# EasyEDA schematic 8bit.json

## Sheets
1 PC
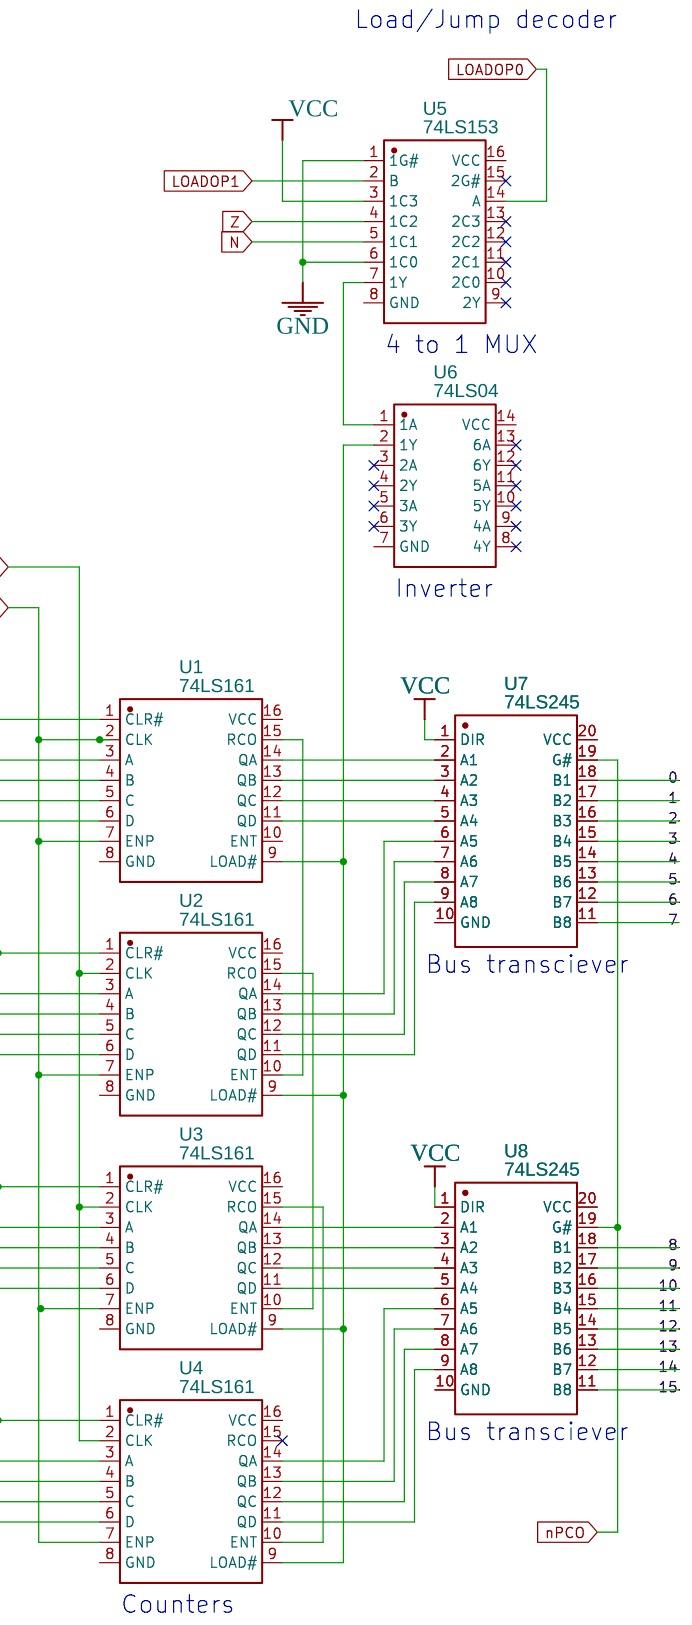
[diagram p0: PC]
2 ALU
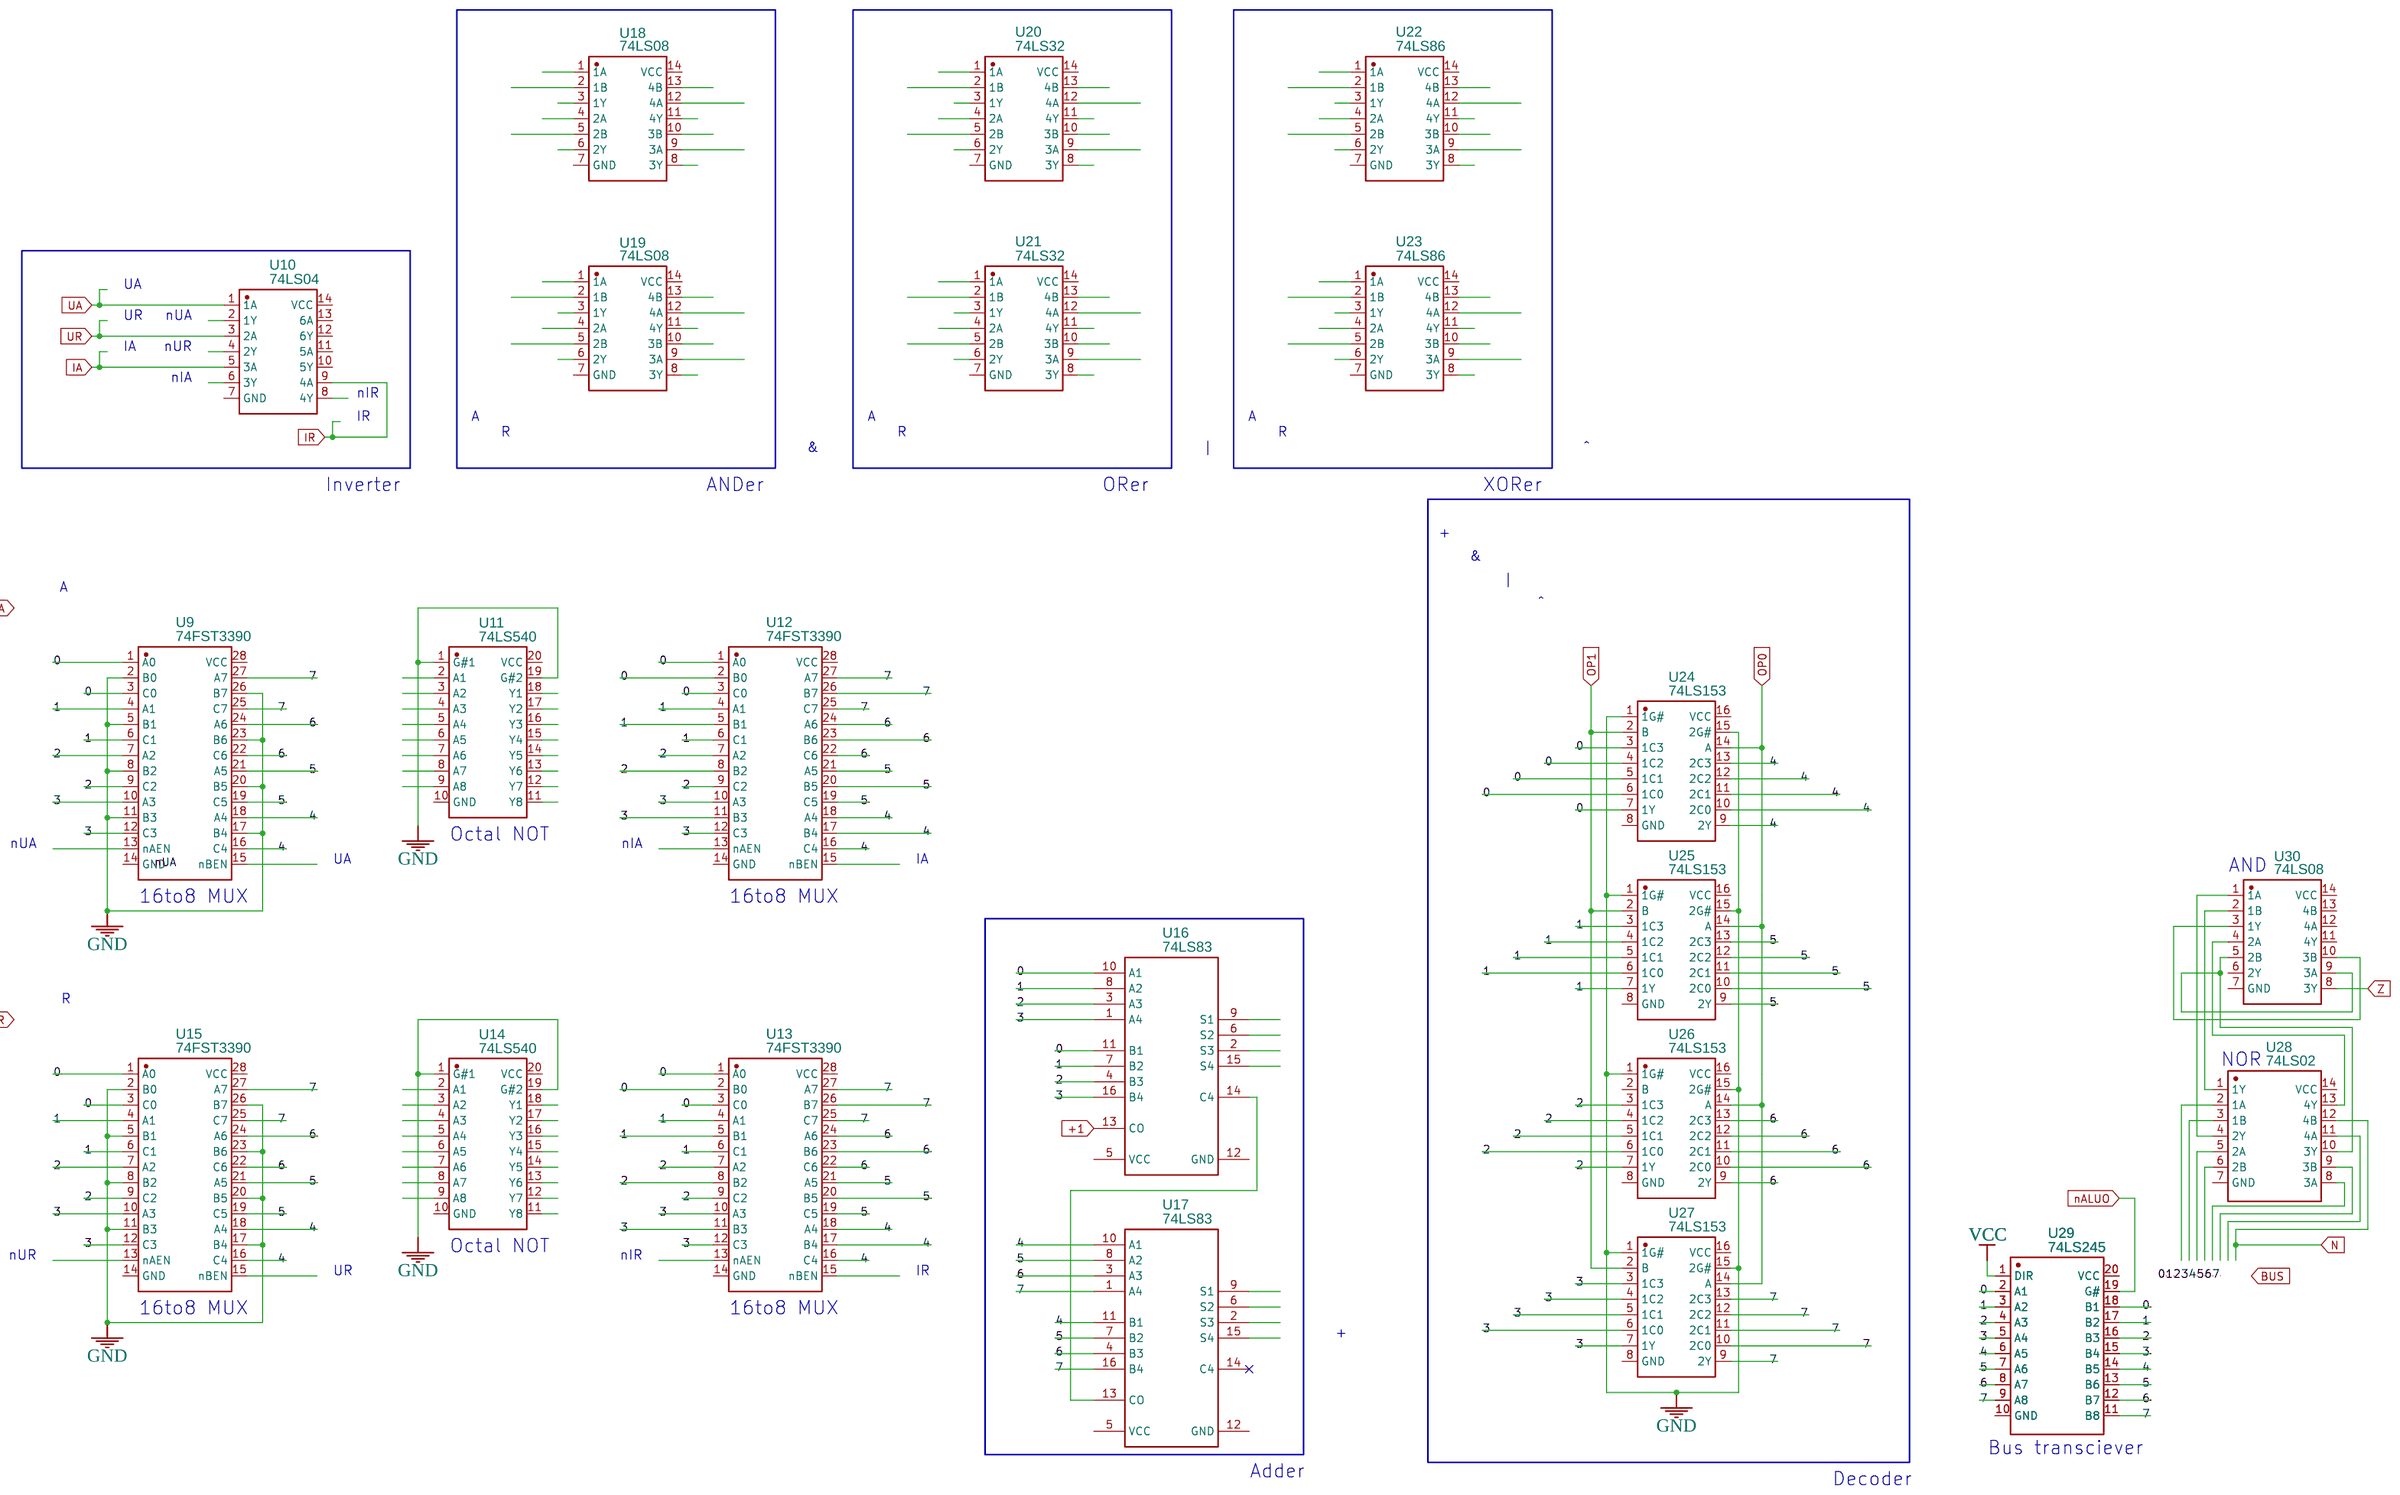
[diagram p1: ALU]

## Parts
sheet ALU
U9  74FST3390
U10  74LS04  [SOP-14_L8.6-W3.9-P1.27-LS6.0-BL]
U11  74LS540  [SOIC-20_L12.8-W7.5-P1.27-LS10.3-BL]
U12  74FST3390
U13  74FST3390
U14  74LS540  [SOIC-20_L12.8-W7.5-P1.27-LS10.3-BL]
U15  74FST3390
U16  74LS83  [DIP16]
U17  74LS83  [DIP16]
U18  74LS08  [SOP-14_L8.6-W3.9-P1.27-LS6.0-BL]
U19  74LS08  [SOP-14_L8.6-W3.9-P1.27-LS6.0-BL]
U20  74LS32  [SOIC-14_L8.7-W3.9-P1.27-LS6.0-BL]
U21  74LS32  [SOIC-14_L8.7-W3.9-P1.27-LS6.0-BL]
U22  74LS86  [DIP-14_L20.0-W7.6-P2.54-LS7.6-BL]
U23  74LS86  [DIP-14_L20.0-W7.6-P2.54-LS7.6-BL]
U24  74LS153  [SOIC-16_L9.9-W3.9-P1.27-LS6.0-BL]
U25  74LS153  [SOIC-16_L9.9-W3.9-P1.27-LS6.0-BL]
U26  74LS153  [SOIC-16_L9.9-W3.9-P1.27-LS6.0-BL]
U27  74LS153  [SOIC-16_L9.9-W3.9-P1.27-LS6.0-BL]
U28  74LS02  [SOIC-14_L8.7-W3.9-P1.27-LS6.0-BL]
U29  74LS245  [SOIC-20_L13.0-W7.6-P1.27-LS10.3-BL]
U30  74LS08  [SOP-14_L8.6-W3.9-P1.27-LS6.0-BL]
sheet PC
U1  74LS161  [PDIP-16_L19.3-W6.4-P2.54-LS7.9-BL]
U2  74LS161  [PDIP-16_L19.3-W6.4-P2.54-LS7.9-BL]
U3  74LS161  [PDIP-16_L19.3-W6.4-P2.54-LS7.9-BL]
U4  74LS161  [PDIP-16_L19.3-W6.4-P2.54-LS7.9-BL]
U5  74LS153  [PDIP-16_L19.3-W6.4-P2.54-LS7.9-BL]
U6  74LS04  [SOP-14_L8.6-W3.9-P1.27-LS6.0-BL]
U7  74LS245  [SOIC-20_L13.0-W7.6-P1.27-LS10.3-BL]
U8  74LS245  [SOIC-20_L13.0-W7.6-P1.27-LS10.3-BL]

## Library data of the parts
U9 U12 U13 U15 = 74FST3390: Contributor: Guest
U6 U10 = XL74LS04: Supplier: LCSC; Supplier Part: C513511; Manufacturer: XINLUDA(信路达); Contributor: LCSC; JLCPCB Part Class: Extended Part
U11 U14 = SN74LS540DW: Supplier: LCSC; Supplier Part: C1548464; Manufacturer: TI(德州仪器); JLCPCB Part Class: Extended Part; Contributor: LCSC
U16 U17 = HD74LS83AP: 4-bit Binary Full Adder with Fast Carry
U18 U19 U30 = XL74LS08: Supplier: LCSC; Supplier Part: C521140; Manufacturer: XINLUDA(信路达); Contributor: LCSC; JLCPCB Part Class: Extended Part
U20 U21 = SN74LS32D: Supplier: LCSC; Supplier Part: C2869302; Manufacturer: TI(德州仪器); link: https://atta.szlcsc.comnull; Contributor: LCSC
U22 U23 = XD74LS86: Supplier: LCSC; Supplier Part: C556290; Manufacturer: XINLUDA(信路达); Contributor: LCSC; JLCPCB Part Class: Extended Part
U24-U27 = SN74LS153D: Supplier: LCSC; Supplier Part: C1547147; Manufacturer: TI(德州仪器); Contributor: LCSC; JLCPCB Part Class: Extended Part
U28 = SN74LS02D: Supplier: LCSC; Supplier Part: C2878666; Manufacturer: TI(德州仪器); link: https://atta.szlcsc.comnull; Contributor: LCSC
U7 U8 U29 = 74LS245WMX: Supplier: LCSC; Manufacturer: TI; Supplier Part: C6034
U1-U4 = SN74LS161AN: Supplier: LCSC; Supplier Part: C1547960; Manufacturer: TI(德州仪器); Contributor: LCSC; JLCPCB Part Class: Extended Part
U5 = SN74LS153N: Supplier: LCSC; Supplier Part: C1547278; Manufacturer: TI(德州仪器); Contributor: LCSC; JLCPCB Part Class: Extended Part

## Nets
GND: U5.1(1G#) U5.6(1C0) U9.2(B0) U9.5(B1) U9.8(B2) U9.11(B3) U9.17(B4) U9.20(B5) U9.23(B6) U9.26(B7) U11.1(G#1) U11.19(G#2) U14.1(G#1) U14.19(G#2) U15.2(B0) U15.5(B1) U15.8(B2) U15.11(B3) U15.17(B4) U15.20(B5) U15.23(B6) U15.26(B7) U24.1(1G#) U24.15(2G#) U25.1(1G#) U25.15(2G#) U26.1(1G#) U26.15(2G#) U27.1(1G#) U27.15(2G#)
VCC: U5.3(1C3) U7.1(DIR) U8.1(DIR) U29.1(DIR)
0: U1.3(A) U7.18(B1) U9.1(A0) U9.3(C0) U12.1(A0) U12.2(B0) U12.3(C0) U13.1(A0) U13.2(B0) U13.3(C0) U15.1(A0) U15.3(C0) U16.10(A1) U16.11(B1) U24.3(1C3) U24.4(1C2) U24.5(1C1) U24.6(1C0) U24.7(1Y) U29.2(A1) U29.18(B1)
1: U1.4(B) U7.17(B2) U9.4(A1) U9.6(C1) U12.4(A1) U12.5(B1) U12.6(C1) U13.4(A1) U13.5(B1) U13.6(C1) U15.4(A1) U15.6(C1) U16.7(B2) U16.8(A2) U25.3(1C3) U25.4(1C2) U25.5(1C1) U25.6(1C0) U25.7(1Y) U29.3(A2) U29.17(B2)
2: U1.5(C) U7.16(B3) U9.7(A2) U9.9(C2) U12.7(A2) U12.8(B2) U12.9(C2) U13.7(A2) U13.8(B2) U13.9(C2) U15.7(A2) U15.9(C2) U16.3(A3) U16.4(B3) U26.3(1C3) U26.4(1C2) U26.5(1C1) U26.6(1C0) U26.7(1Y) U29.4(A3) U29.16(B3)
3: U1.6(D) U7.15(B4) U9.10(A3) U9.12(C3) U12.10(A3) U12.11(B3) U12.12(C3) U13.10(A3) U13.11(B3) U13.12(C3) U15.10(A3) U15.12(C3) U16.1(A4) U16.16(B4) U27.3(1C3) U27.4(1C2) U27.5(1C1) U27.6(1C0) U27.7(1Y) U29.5(A4) U29.15(B4)
4: U2.3(A) U7.14(B5) U9.16(C4) U9.18(A4) U12.16(C4) U12.17(B4) U12.18(A4) U13.16(C4) U13.17(B4) U13.18(A4) U15.16(C4) U15.18(A4) U17.10(A1) U17.11(B1) U24.9(2Y) U24.10(2C0) U24.11(2C1) U24.12(2C2) U24.13(2C3) U29.6(A5) U29.14(B5)
5: U2.4(B) U7.13(B6) U9.19(C5) U9.21(A5) U12.19(C5) U12.20(B5) U12.21(A5) U13.19(C5) U13.20(B5) U13.21(A5) U15.19(C5) U15.21(A5) U17.7(B2) U17.8(A2) U25.9(2Y) U25.10(2C0) U25.11(2C1) U25.12(2C2) U25.13(2C3) U29.7(A6) U29.13(B6)
6: U2.5(C) U7.12(B7) U9.22(C6) U9.24(A6) U12.22(C6) U12.23(B6) U12.24(A6) U13.22(C6) U13.23(B6) U13.24(A6) U15.22(C6) U15.24(A6) U17.3(A3) U17.4(B3) U26.9(2Y) U26.10(2C0) U26.11(2C1) U26.12(2C2) U26.13(2C3) U29.8(A7) U29.12(B7)
7: U2.6(D) U7.11(B8) U9.25(C7) U9.27(A7) U12.25(C7) U12.26(B7) U12.27(A7) U13.25(C7) U13.26(B7) U13.27(A7) U15.25(C7) U15.27(A7) U17.1(A4) U17.16(B4) U27.9(2Y) U27.10(2C0) U27.11(2C1) U27.12(2C2) U27.13(2C3) U29.9(A8) U29.11(B8)
8: U3.3(A) U8.18(B1)
9: U3.4(B) U8.17(B2)
10: U3.5(C) U8.16(B3)
11: U3.6(D) U8.15(B4)
12: U4.3(A) U8.14(B5)
13: U4.4(B) U8.13(B6)
14: U4.5(C) U8.12(B7)
15: U4.6(D) U8.11(B8)
+1: U16.13(CO)
CLK: U2.2(CLK) U3.2(CLK) U4.2(CLK)
IA: U10.5(3A)
INC: U1.2(CLK) U1.7(ENP) U2.7(ENP) U3.7(ENP) U4.7(ENP)
IR: U10.9(4A)
LOADOP0: U5.14(A)
LOADOP1: U5.2(B)
N: U5.5(1C1) U28.12(4B)
nALUO: U29.19(G#)
nCLR: U1.1(CLR#) U2.1(CLR#) U3.1(CLR#) U4.1(CLR#)
nPCO: U7.19(G#) U8.19(G#)
OP0: U24.14(A) U25.14(A) U26.14(A) U27.14(A)
OP1: U24.2(B) U25.2(B) U27.2(B)
UA: U10.1(1A)
UR: U10.3(2A)
Z: U5.4(1C2) U30.8(3Y)
Net-(U1-9): U1.9(LOAD#) U2.9(LOAD#) U3.9(LOAD#) U4.9(LOAD#) U6.2(1Y)
Net-(U1-11): U1.11(QD) U7.5(A4)
Net-(U1-12): U1.12(QC) U7.4(A3)
Net-(U1-13): U1.13(QB) U7.3(A2)
Net-(U1-14): U1.14(QA) U7.2(A1)
Net-(U1-15): U1.15(RCO) U2.10(ENT)
Net-(U2-11): U2.11(QD) U7.9(A8)
Net-(U2-12): U2.12(QC) U7.8(A7)
Net-(U2-13): U2.13(QB) U7.7(A6)
Net-(U2-14): U2.14(QA) U7.6(A5)
Net-(U2-15): U2.15(RCO) U3.10(ENT)
Net-(U3-11): U3.11(QD) U8.5(A4)
Net-(U3-12): U3.12(QC) U8.4(A3)
Net-(U3-13): U3.13(QB) U8.3(A2)
Net-(U3-14): U3.14(QA) U8.2(A1)
Net-(U3-15): U3.15(RCO) U4.10(ENT)
Net-(U4-11): U4.11(QD) U8.9(A8)
Net-(U4-12): U4.12(QC) U8.8(A7)
Net-(U4-13): U4.13(QB) U8.7(A6)
Net-(U4-14): U4.14(QA) U8.6(A5)
Net-(U5-7): U5.7(1Y) U6.1(1A)
Net-(U16-14): U16.14(C4) U17.13(CO)
Net-(U28-1): U28.1(1Y) U30.2(1B)
Net-(U28-4): U28.4(2Y) U30.1(1A)
Net-(U28-10): U28.10(3Y) U30.5(2B) U30.9(3A)
Net-(U28-13): U28.13(4Y) U30.4(2A)
Net-(U30-3): U30.3(1Y) U30.10(3B)

Not connected (* = marked no-connect by the designer): U1 8(GND) 10(ENT) 16(VCC); U2 8(GND) 16(VCC); U3 8(GND) 16(VCC); U4 8(GND) 15(RCO)* 16(VCC); U5 8(GND) 9(2Y)* 10(2C0)* 11(2C1)* 12(2C2)* 13(2C3)* 15(2G#)* 16(VCC); U6 3(2A)* 4(2Y)* 5(3A)* 6(3Y)* 7(GND) 8(4Y)* 9(4A)* 10(5Y)* 11(5A)* 12(6Y)* 13(6A)* 14(VCC); U7 10(GND) 20(VCC); U8 10(GND) 20(VCC); U9 13(nAEN) 14(GND) 15(nBEN) 28(VCC); U10 2(1Y) 4(2Y) 6(3Y) 7(GND) 8(4Y) 10(5Y) 11(5A) 12(6Y) 13(6A) 14(VCC); U11 2(A1) 3(A2) 4(A3) 5(A4) 6(A5) 7(A6) 8(A7) 9(A8) 10(GND) 11(Y8) 12(Y7) 13(Y6) 14(Y5) 15(Y4) 16(Y3) 17(Y2) 18(Y1) 20(VCC); U12 13(nAEN) 14(GND) 15(nBEN) 28(VCC); U13 13(nAEN) 14(GND) 15(nBEN) 28(VCC); U14 2(A1) 3(A2) 4(A3) 5(A4) 6(A5) 7(A6) 8(A7) 9(A8) 10(GND) 11(Y8) 12(Y7) 13(Y6) 14(Y5) 15(Y4) 16(Y3) 17(Y2) 18(Y1) 20(VCC); U15 13(nAEN) 14(GND) 15(nBEN) 28(VCC); U16 2(S3) 5(VCC) 6(S2) 9(S1) 12(GND) 15(S4); U17 2(S3) 5(VCC) 6(S2) 9(S1) 12(GND) 14(C4)* 15(S4); U18 1(1A) 2(1B) 3(1Y) 4(2A) 5(2B) 6(2Y) 7(GND) 8(3Y) 9(3A) 10(3B) 11(4Y) 12(4A) 13(4B) 14(VCC); U19 1(1A) 2(1B) 3(1Y) 4(2A) 5(2B) 6(2Y) 7(GND) 8(3Y) 9(3A) 10(3B) 11(4Y) 12(4A) 13(4B) 14(VCC); U20 1(1A) 2(1B) 3(1Y) 4(2A) 5(2B) 6(2Y) 7(GND) 8(3Y) 9(3A) 10(3B) 11(4Y) 12(4A) 13(4B) 14(VCC); U21 1(1A) 2(1B) 3(1Y) 4(2A) 5(2B) 6(2Y) 7(GND) 8(3Y) 9(3A) 10(3B) 11(4Y) 12(4A) 13(4B) 14(VCC); U22 1(1A) 2(1B) 3(1Y) 4(2A) 5(2B) 6(2Y) 7(GND) 8(3Y) 9(3A) 10(3B) 11(4Y) 12(4A) 13(4B) 14(VCC); U23 1(1A) 2(1B) 3(1Y) 4(2A) 5(2B) 6(2Y) 7(GND) 8(3Y) 9(3A) 10(3B) 11(4Y) 12(4A) 13(4B) 14(VCC); U24 8(GND) 16(VCC); U25 8(GND) 16(VCC); U26 2(B) 8(GND) 16(VCC); U27 8(GND) 16(VCC); U28 2(1A) 3(1B) 5(2A) 6(2B) 7(GND) 8(3A) 9(3B) 11(4A) 14(VCC); U29 10(GND) 20(VCC); U30 6(2Y) 7(GND) 11(4Y) 12(4A) 13(4B) 14(VCC)

## Notes on the sheets
sheet 1
- Load/Jump decoder
- 4 to 1 MUX
- Inverter
- Bus transciever
- Bus transciever
- Counters
sheet 2
- UA
- UR
- nUA
- IA
- nUR
- nIA
- nIR
- IR
- A
- A
- A
- R
- R
- R
- &
- |
- ^
- Inverter
- ANDer
- ORer
- XORer
- +
- &
- |
- A
- ^
- Octal NOT
- nUA
- nIA
- UA
- IA
- AND
- 16to8 MUX
- 16to8 MUX
- R
- NOR
- Octal NOT
- nUR
- nIR
- UR
- IR
- 16to8 MUX
- 16to8 MUX
- +
- Bus transciever
- Adder
- Decoder
